# EAGLE design CAN Power (EAGLE 9.5.2)
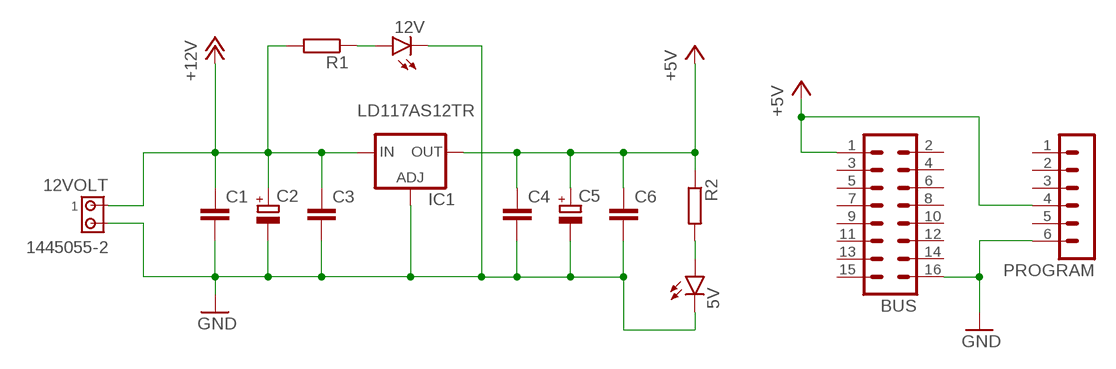
[diagram p0: schematic, sheet 1]

## Parts
5V  LED3MM  [LED3MM]
12V  LED3MM  [LED3MM]
12VOLT  1445055-2  [1445055-2]
BUS  MA08-2  [MA08-2]
C1  C-EUC0402  [C0402]
C2  CPOL-EUC/6032-28R  [C/6032-28R]
C3  C-EUC0402  [C0402]
C4  C-EUC0402  [C0402]
C5  CPOL-EUC/6032-28R  [C/6032-28R]
C6  C-EUC0402  [C0402]
IC1  LD117AS12TR  [SOT223]
PROGRAM  MA06-1  [MA06-1]
R1  R-EU_R0402  [R0402]
R2  R-EU_R0402  [R0402]

## Nets
+5V: BUS.1 C4.1 C5.+ C6.1 IC1.4(OUT) PROGRAM.4 R2.1
+12V: 12VOLT.1 C1.1 C2.+ C3.1 IC1.3(IN) R1.2
GND: 5V.K(C) 12V.K(C) 12VOLT.2 BUS.16 C1.2 C2.- C3.2 C4.2 C5.- C6.2 IC1.1(ADJ) PROGRAM.6
N$1: 5V.A R2.2
N$2: 12V.A R1.1
Unconnected: BUS.2 BUS.3 BUS.4 BUS.5 BUS.6 BUS.7 BUS.8 BUS.9 BUS.10 BUS.11 BUS.12 BUS.13 BUS.14 BUS.15 PROGRAM.1 PROGRAM.2 PROGRAM.3 PROGRAM.5

## Library data of the parts
5V 12V = led:LED: LED OSRAM: - CHIPLED LG R971, LG N971, LY N971, LG Q971, LY Q971, LO R971, LY R971 LH N974, LH R974 LS Q976, LO Q976, LY Q976 LO Q996 - Hyper CHIPLED LW Q18S LB Q993, LB Q99A, LB R99A - SideLED LS A670, LO A670, LY A670, LG A670, LP A670 LB A673, LV A673, LT A673, LW A673 LH A674 LY A675 LS A676, LA A676, LO A676, LY A676, LW A676 LS A679, LY A679, LG A679 - Hyper Micro SIDELED® LS Y876, LA Y876, LO Y876, LY Y876 LT Y87S - SmartLED LW L88C, LW L88S LB L89C, LB L89S, LG L890 LS L89K, LO L89K, LY L89K LS L896, LA L896, LO L896, LY L896 - TOPLED LS T670, LO T670, LY T670, LG T670, LP T670 LSG T670, LSP T670, LSY T670, LOP T670, LYG T670 LG T671, LOG T671, LSG T671 LB T673, LV T673, LT T673, LW T673 LH T674 LS T676, LA T676, LO T676, LY T676, LB T676, LH T676, LSB T676, LW T676 LB T67C, LV T67C, LT T67C, LS T67K, LO T67K, LY T67K, LW E67C LS E67B, LA E67B, LO E67B, LY E67B, LB E67C, LV E67C, LT E67C LW T67C LS T679, LY T679, LG T679 LS T770, LO T770, LY T770, LG T770, LP T770 LB T773, LV T773, LT T773, LW T773 LH T774 LS E675, LA E675, LY E675, LS T675 LS T776, LA T776, LO T776, LY T776, LB T776 LHGB T686 LT T68C, LB T68C - Hyper Mini TOPLED® LB M676 - Mini TOPLED Santana® LG M470 LS M47K, LO M47K, LY M47K Source: http://www.osram.convergy.de LUXEON: - LUMILED® LXK2-PW12-R00, LXK2-PW12-S00, LXK2-PW14-U00, LXK2-PW14-V00 LXK2-PM12-R00, LXK2-PM12-S00, LXK2-PM14-U00 LXK2-PE12-Q00, LXK2-PE12-R00, LXK2-PE12-S00, LXK2-PE14-T00, LXK2-PE14-U00 LXK2-PB12-K00, LXK2-PB12-L00, LXK2-PB12-M00, LXK2-PB14-N00, LXK2-PB14-P00, LXK2-PB14-Q00 LXK2-PR12-L00, LXK2-PR12-M00, LXK2-PR14-Q00, LXK2-PR14-R00 LXK2-PD12-Q00, LXK2-PD12-R00, LXK2-PD12-S00 LXK2-PH12-R00, LXK2-PH12-S00 LXK2-PL12-P00, LXK2-PL12-Q00, LXK2-PL12-R00 Source: www.luxeon.com KINGBRIGHT: KA-3528ASYC Source: www.kingbright.com
12VOLT = con-amp:1445055-2: Micro MATE-N-LOK Connectors grid 1.5 mm Source: ENG_CD_1445055_A.pdf
BUS = con-lstb:MA08-2: PIN HEADER; OC_FARNELL: unknown; OC_NEWARK: unknown
C1 C3 C4 C6 = rcl:C-EU: CAPACITOR, European symbol; SPICEPREFIX: C
C2 C5 = rcl:CPOL-EU: POLARIZED CAPACITOR, European symbol; SPICEPREFIX: C
IC1 = v-reg:LD117A?*: Low drop fixed and adjustable positive voltage regulators 1 A Source: http://www.st.com/stonline/products/literature/ds/7194/ld1117axx.pdf
PROGRAM = con-lstb:MA06-1: PIN HEADER; OC_FARNELL: unknown; OC_NEWARK: unknown
R1 R2 = rcl:R-EU_: RESISTOR, European symbol; SPICEPREFIX: R

## Board
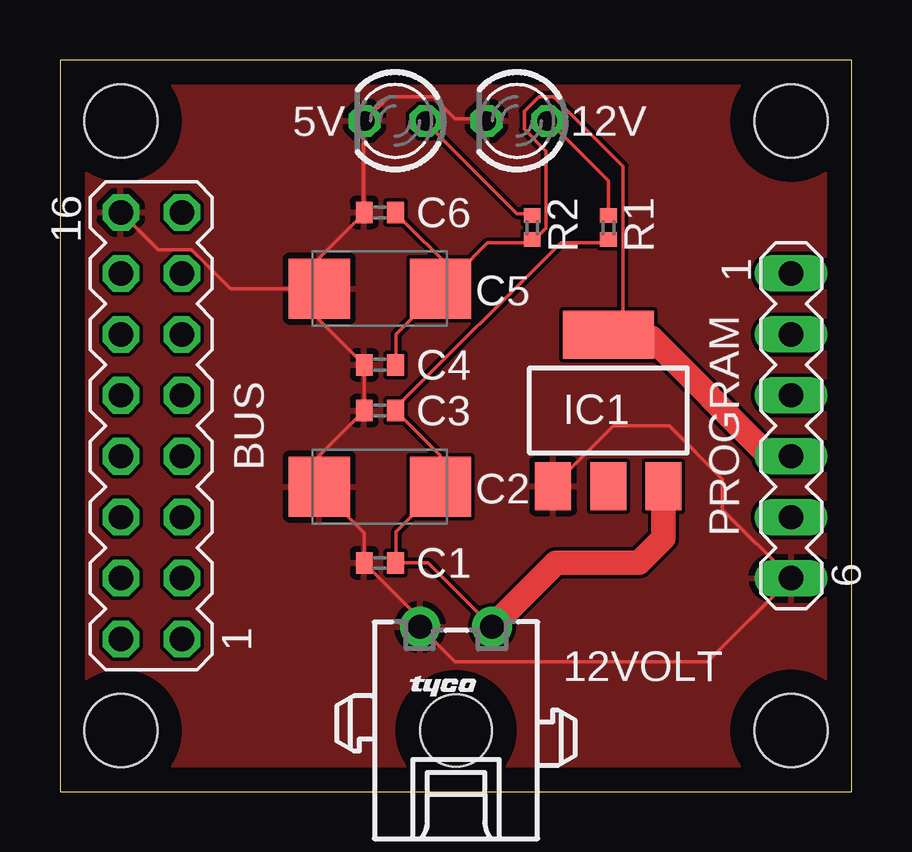
[diagram p1: board, top side]
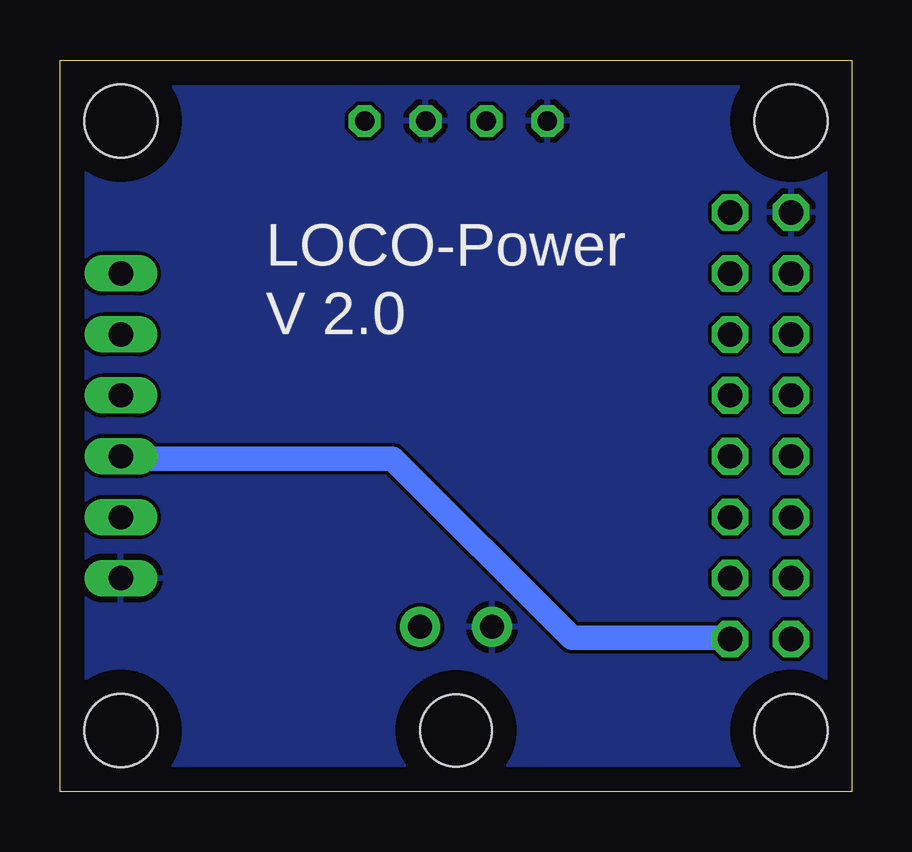
[diagram p2: board, bottom side, seen from below]

Size 33.02 x 30.48 mm. Coordinates in mm from the lower left corner, seen from the top.
Outline: 0,0 33.02,0 33.02,30.48 0,30.48 0,0
Copper layers (1*16): Top 0.035mm / dielectric 1.5mm / Bottom 0.035mm
Design rules "default": minimum track width 6mil, minimum drill 0.35mm, track to track 6mil, track to pad 6mil, pad to pad 6mil, via to via 6mil, smd to smd 6mil, copper to edge 40mil, drill to drill 6mil, minimum pad ring 10mil, minimum via ring 8mil, stop-mask expansion 4mil, vias tented up to drill 0mil, thermal gap 10mil
Holes 3.05 mm at 2.54,2.54 2.54,27.94 30.48,27.94 30.48,2.54

### Footprints (pad centres in the part's own frame; a part is rotated, then mirrored left to right if it is on the bottom)
LED3MM = drill 0.813 octagon: A -1.27,0; K 1.27,0
1445055-2 = drill 1 pad 1.676: 1 1.5,4.32; 2 -1.5,4.32 | hole 3: 0,0
MA08-2 = drill 1.016 octagon: 1 -8.89,-1.27; 2 -8.89,1.27; 3 -6.35,-1.27; 4 -6.35,1.27; 5 -3.81,-1.27; 6 -3.81,1.27; 7 -1.27,-1.27; 8 -1.27,1.27; 9 1.27,-1.27; 10 1.27,1.27; 11 3.81,-1.27; 12 3.81,1.27; 13 6.35,-1.27; 14 6.35,1.27; 15 8.89,-1.27; 16 8.89,1.27
C0402 = smd 0.7 x 0.9: 1 -0.65,0; 2 0.65,0
C/6032-28R = smd 2.55 x 2.5: + 2.525,0; - -2.525,0
SOT223 = smd 1.5 x 2: 1 -2.3,-3.15; 2 0,-3.15; 3 2.3,-3.15 | smd 3.8 x 2: 4 0,3.15
MA06-1 = drill 1.016 long: 1 -6.35,0; 2 -3.81,0; 3 -1.27,0; 4 1.27,0; 5 3.81,0; 6 6.35,0
R0402 = smd 0.6 x 0.7: 1 -0.5,0; 2 0.5,0

### Placement (x,y rotation side)
5V  13.97,27.94 180 top
12V  19.05,27.94 180 top
12VOLT  16.51,2.54 0 top
BUS  3.81,15.24 90 top
C1  13.34,9.53 180 top
C2  13.34,12.7 0 top
C3  13.34,15.88 180 top
C4  13.34,17.78 180 top
C5  13.34,20.95 0 top
C6  13.34,24.13 180 top
IC1  22.86,15.88 0 top
PROGRAM  30.48,15.24 270 top
R1  22.86,23.5 270 top
R2  19.68,23.5 90 top

### Tracks (layer width: path | path; a pad name or v marks a point on that pad's centre or on a via)
+5V
  Top 0.152: 16.61,21.64 16,21.03 C5.+ | 16.61,21.64 17.83,22.86 19.66,22.86 R2.1 19.81,23.01 20.27,23.47 20.27,26.67 19.36,27.58 19.36,28.35 19.96,28.96 20.57,28.96 23.47,26.06 23.47,18.9 | C4.1 14.02,17.83 14.02,19.05 15.85,20.88 C5.+ | 16.61,21.64 16.46,21.64 14.02,24.08 C6.1 | 16.61,21.64 C5.+ | 23.47,18.9 22.86,18.9 IC1.4 23.47,18.9
  Top 1.016: 23.47,18.9 24.65,18.9 29.58,13.97 PROGRAM.4
  Bottom 0.152: 30.48,13.87 PROGRAM.4
  Bottom 0.508: 5.18,6.4 BUS.1
  Bottom 1.016: 5.18,6.4 11.68,6.4 19.15,13.87 30.48,13.87
+12V
  Top 0.152: R1.2 22.86,22.86 20.88,22.86 14.02,16 C3.1 14.02,15.85 15.85,14.02 15.85,12.8 C2.+ 15.85,12.65 14.02,10.82 14.02,9.6 C1.1 15.35,9.53 12VOLT.1
  Top 1.016: 12VOLT.1 20.68,9.53 24.13,9.53 25.16,10.55 IC1.3
GND
  Top 0.152: C5.- 10.82,21.03 10.82,22.25 12.65,24.08 C6.2 12.65,24.23 12.65,27.89 5V.K 13.72,28.96 15.54,28.96 16.46,28.04 17.68,28.04 12V.K | 12.65,17.83 12.69,17.8 C3.2 10.81,14 C2.- 10.82,12.65 12.69,10.79 C1.2 15.01,7.2 12VOLT.2 16.47,5.4 26.99,5.4 PROGRAM.6 27.62,11.75 27.62,13.02 25.4,15.24 23.07,15.24 IC1.1 | C4.2 10.81,19.66 C5.- | C5.- 7.12,20.95 5.49,22.58 4.09,22.58 BUS.16
  Top 0.508: 12.65,17.83 C4.2
  pour Top: 0,30.48 33.02,30.48 33.02,0 0,0
  pour Bottom: 0,30.48 33.02,30.48 33.02,0 0,0
N$1
  Top 0.152: R2.2 19.66,24.08 19.05,24.08 15.24,27.89 5V.A
N$2
  Top 0.152: R1.1 22.86,25.45 20.42,27.89 12V.A

### Text on the board
bNames: LOCO-Power | V 2.0